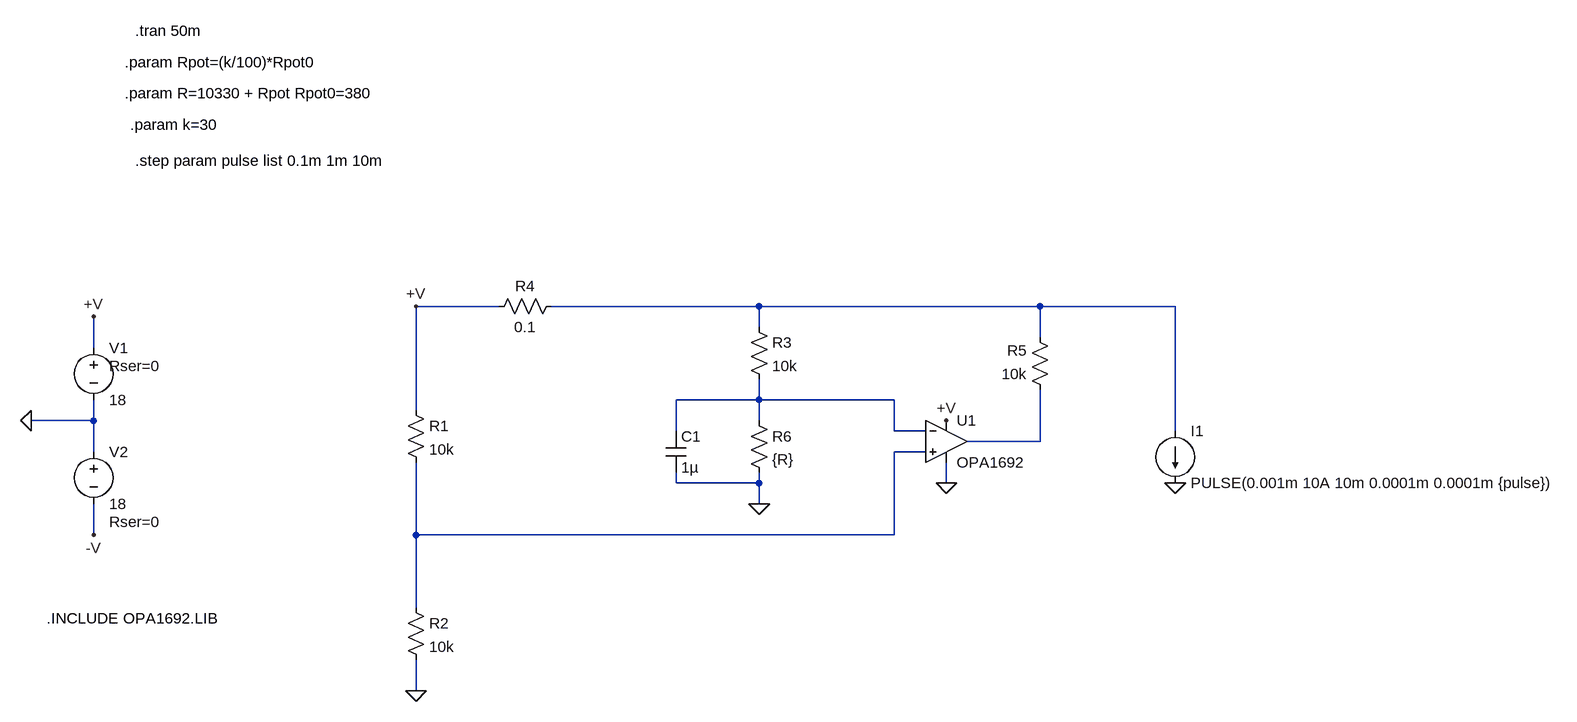
[diagram p0: schematic Comaprator - step response (capacitor).asc]
Comaprator - step response (capacitor).asc, the LTspice schematic file:
Version 4
SHEET 1 1816 680
WIRE 144 -208 16 -208
WIRE 544 -208 224 -208
WIRE 976 -208 544 -208
WIRE 1184 -208 976 -208
WIRE 544 -176 544 -208
WIRE 976 -160 976 -208
WIRE -480 -144 -480 -192
WIRE 544 -64 544 -96
WIRE 544 -64 416 -64
WIRE 752 -64 544 -64
WIRE 16 -48 16 -208
WIRE -480 -32 -480 -64
WIRE -480 -32 -576 -32
WIRE 544 -32 544 -64
WIRE 416 -16 416 -64
WIRE 752 -16 752 -64
WIRE 800 -16 752 -16
WIRE 1184 -16 1184 -208
WIRE 976 0 976 -80
WIRE 976 0 864 0
WIRE -480 16 -480 -32
WIRE 800 16 752 16
WIRE 416 64 416 48
WIRE 544 64 544 48
WIRE 544 64 416 64
WIRE 832 64 832 32
WIRE 544 96 544 64
WIRE -480 144 -480 96
WIRE 16 144 16 32
WIRE 752 144 752 16
WIRE 752 144 16 144
WIRE 16 256 16 144
WIRE 16 384 16 336
FLAG 16 -208 +V
FLAG 16 384 0
FLAG 832 -32 +V
FLAG -576 -32 0
FLAG -480 -192 +V
FLAG -480 144 -V
FLAG 544 96 0
FLAG 1184 64 0
FLAG 832 64 0
SYMBOL res 0 -64 R0
SYMATTR InstName R1
SYMATTR Value 10k
SYMBOL res 0 240 R0
SYMATTR InstName R2
SYMATTR Value 10k
SYMBOL res 240 -224 R90
WINDOW 0 0 56 VBottom 2
WINDOW 3 32 56 VTop 2
SYMATTR InstName R4
SYMATTR Value 0.1
SYMBOL res 992 -64 R180
WINDOW 0 36 76 Left 2
WINDOW 3 36 40 Left 2
SYMATTR InstName R5
SYMATTR Value 10k
SYMBOL voltage -480 -160 R0
WINDOW 123 0 0 Left 0
WINDOW 39 24 44 Left 2
SYMATTR SpiceLine Rser=0
SYMATTR InstName V1
SYMATTR Value 18
SYMBOL voltage -480 0 R0
WINDOW 123 0 0 Left 0
WINDOW 39 24 124 Left 2
SYMATTR SpiceLine Rser=0
SYMATTR InstName V2
SYMATTR Value 18
SYMBOL res 528 -192 R0
SYMATTR InstName R3
SYMATTR Value 10k
SYMBOL res 528 -48 R0
SYMATTR InstName R6
SYMATTR Value {R}
SYMBOL current 1184 -16 R0
WINDOW 123 0 0 Left 0
WINDOW 39 0 0 Left 0
SYMATTR InstName I1
SYMATTR Value PULSE(0.001m 10A 10m 0.0001m 0.0001m {pulse})
SYMBOL cap 400 -16 R0
SYMATTR InstName C1
SYMATTR Value 1µ
SYMBOL OpAmps\\opamp2 832 -64 R0
SYMATTR InstName U1
SYMATTR Value OPA1692
TEXT -552 272 Left 2 !.INCLUDE OPA1692.LIB
TEXT -432 -584 Left 2 !.param Rpot=(k/100)*Rpot0
TEXT -432 -536 Left 2 !.param R=10330 + Rpot Rpot0=380
TEXT -416 -632 Left 2 !.tran 50m
TEXT -424 -488 Left 2 !.param k=30
TEXT -416 -432 Left 2 !.step param pulse list 0.1m 1m 10m

The netlist it stands for:
* Comaprator - step response (capacitor).asc
R1 +V N004 10k
R2 N004 0 10k
R4 N001 +V 0.1
R5 N003 N001 10k
V1 +V 0 18 Rser=0
V2 0 -V 18 Rser=0
R3 N001 N002 10k
R6 N002 0 {R}
I1 N001 0 PULSE(0.001m 10A 10m 0.0001m 0.0001m {pulse})
C1 N002 0 1µ
XU1 N004 N002 +V 0 N003 OPA1692  ; pins In+ In- V+ V- OUT
.INCLUDE OPA1692.LIB
.param Rpot=(k/100)*Rpot0
.param R=10330 + Rpot Rpot0=380
.tran 50m
.param k=30
.step param pulse list 0.1m 1m 10m
.backanno
.end